# EAGLE design TMC2100_BOB_v0_90 (EAGLE 6.5.0)
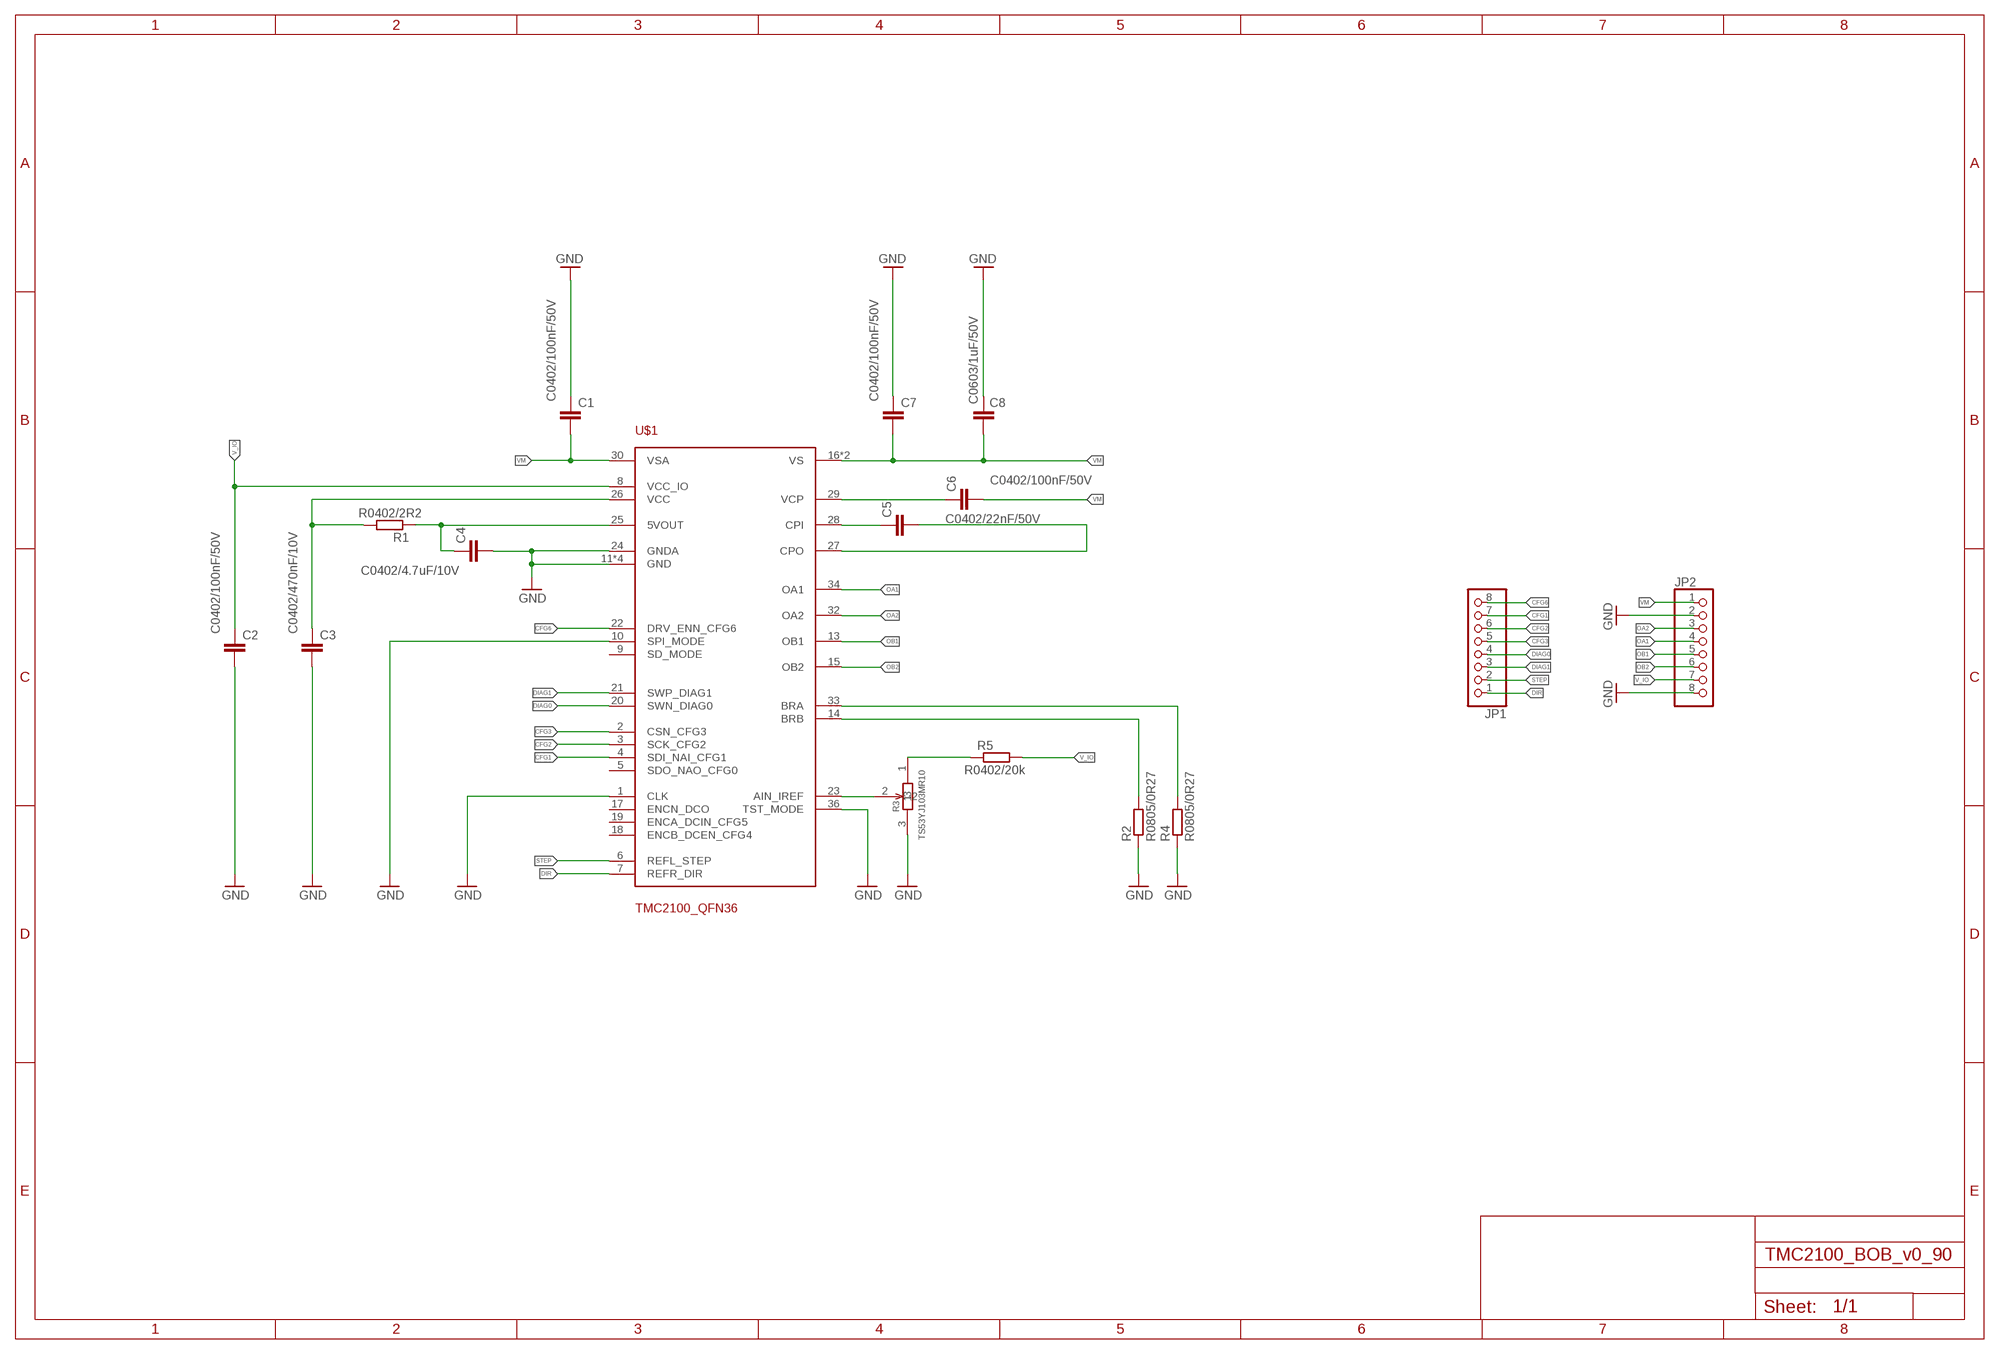
[diagram p0: schematic, sheet 1]

## Parts
C1  C0402/100nF/50V  C-EUC0402  [C0402]
C2  C0402/100nF/50V  C-EUC0402  [C0402]
C3  C0402/470nF/10V  C-EUC0402  [C0402]
C4  C0402/4.7uF/10V  C-EUC0402  [C0402]
C5  C0402/22nF/50V  C-EUC0402  [C0402]
C6  C0402/100nF/50V  C-EUC0402  [C0402]
C7  C0402/100nF/50V  C-EUC0402  [C0402]
C8  C0603/1uF/50V  C-EUC0603  [C0603]
JP1  PINHD-1X08_2.54-S  [1X08-S]
JP2  PINHD-1X08_2.54-S  [1X08-S]
R1  R0402/2R2  R-EU_R0402  [R0402]
R2  R0805/0R27  R-EU_M0805  [M0805]
R3  TS53YJ103MR10  [TS53YJ]
R4  R0805/0R27  R-EU_M0805  [M0805]
R5  R0402/20k  R-EU_R0402  [R0402]
U$1  TMC2100_QFN36  [QFN36]

## Nets
CFG1: JP1.7 U$1.4(SDI_NAI_CFG1)
CFG2: JP1.6 U$1.3(SCK_CFG2)
CFG3: JP1.5 U$1.2(CSN_CFG3)
CFG6: JP1.8 U$1.22(DRV_ENN_CFG6)
DIAG0: JP1.4 U$1.20(SWN_DIAG0)
DIAG1: JP1.3 U$1.21(SWP_DIAG1)
DIR: JP1.1 U$1.7(REFR_DIR)
GND: C1.1 C2.2 C3.2 C4.2 C7.1 C8.2 JP2.2 JP2.8 R2.1 R3.3 R4.1 U$1.1(CLK) U$1.10(SPI_MODE) U$1.11(GND) U$1.12(GND) U$1.24(GNDA) U$1.35(GND) U$1.36(TST_MODE) U$1.GND_PAD(GND)
N$3: C3.1 R1.2 U$1.26(VCC)
N$4: C4.1 R1.1 U$1.25(5VOUT)
N$5: C6.1 U$1.29(VCP)
N$6: C5.1 U$1.28(CPI)
N$7: R4.2 U$1.33(BRA)
N$8: C5.2 U$1.27(CPO)
N$9: R2.2 U$1.14(BRB)
N$10: R3.1 R5.1
N$12: R3.2 U$1.23(AIN_IREF)
OA1: JP2.4 U$1.34(OA1)
OA2: JP2.3 U$1.32(OA2)
OB1: JP2.5 U$1.13(OB1)
OB2: JP2.6 U$1.15(OB2)
STEP: JP1.2 U$1.6(REFL_STEP)
V_IO: C2.1 JP2.7 R5.2 U$1.8(VCC_IO)
VM: C1.2 C6.2 C7.2 C8.1 JP2.1 U$1.16(VS) U$1.30(VSA) U$1.31(VS)
Unconnected: U$1.5(SDO_NAO_CFG0) U$1.9(SD_MODE) U$1.17(ENCN_DCO) U$1.18(ENCB_DCEN_CFG4) U$1.19(ENCA_DCIN_CFG5)

## Library data of the parts
C1-C8 = rcl:C-EU: CAPACITOR, European symbol
JP1 JP2 = pinhead-2:PINHD-1X08: PIN HEADER
R1 R2 R4 R5 = rcl:R-EU_: RESISTOR, European symbol
R3 = TS53YJ103MR10:TS53YJ103MR10
U$1 = TMC2100_QFN:TMC2100_QFN36

## Board
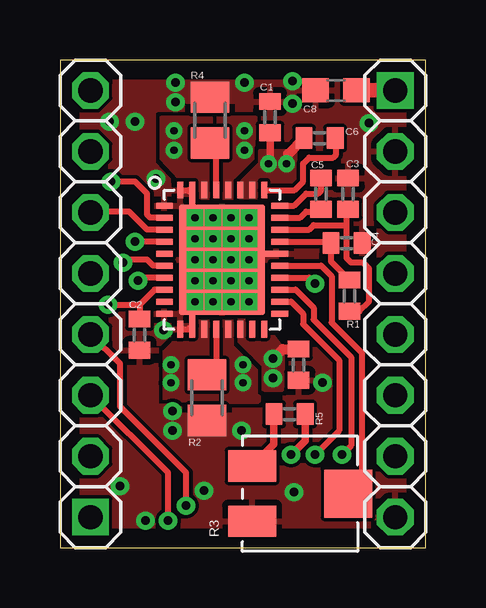
[diagram p1: board, top side]
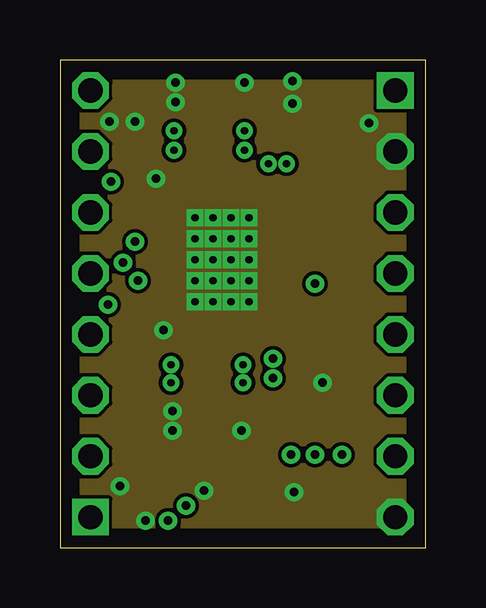
[diagram p2: board, inner layer Ground]
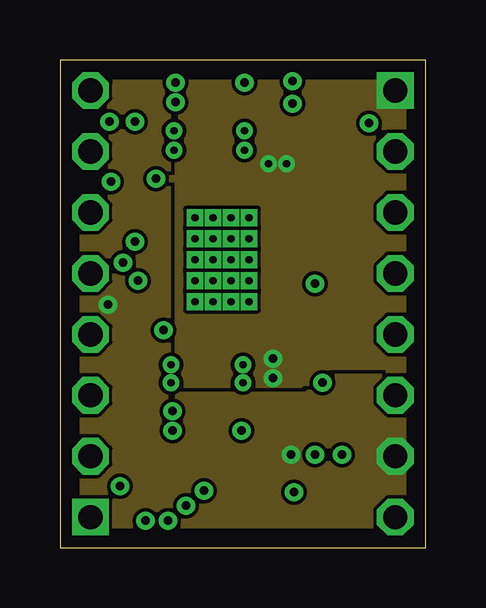
[diagram p3: board, inner layer Supply]
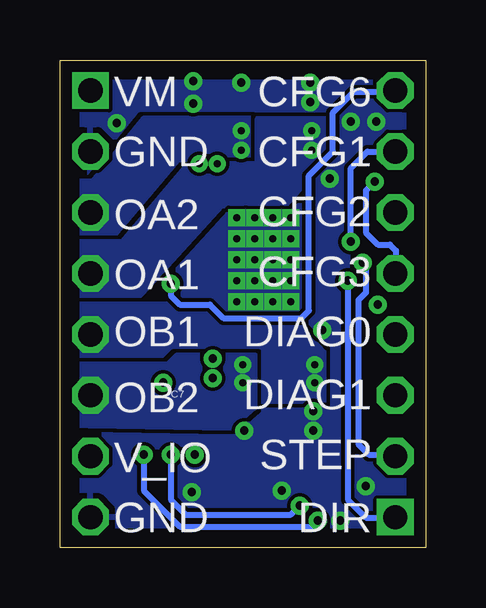
[diagram p4: board, bottom side, seen from below]

Size 15.24 x 20.32 mm. Coordinates in mm from the lower left corner, seen from the top.
Outline: 0,0 15.24,0 15.24,20.32 0,20.32 0,0
Copper layers (1*2*15*16): Top 0.018mm / dielectric 0.36mm / Ground 0.035mm / dielectric 0.71mm / Supply 0.035mm / dielectric 0.2mm / Bottom 0.018mm
Design rules "Default_WE_Euro *": minimum track width 0.15mm, minimum drill 0.25mm, track to track 0.15mm, track to pad 0.15mm, pad to pad 0.1mm, via to via 0.15mm, smd to smd 0mil, copper to edge 0.8mm, drill to drill 8mil, minimum pad ring 10mil, minimum via ring 8mil, stop-mask expansion 4mil, vias tented up to drill 0.4mm, thermal gap 10mil

### Footprints (pad centres in the part's own frame; a part is rotated, then mirrored left to right if it is on the bottom)
C0402 = smd 0.7 x 0.9: 1 -0.65,0; 2 0.65,0
C0603 = smd 1.1 x 1: 1 -0.85,0; 2 0.85,0
1X08-S = drill 1.016 square: 1 -8.89,0 | drill 1.016 octagon: 2 -6.35,0; 3 -3.81,0; 4 -1.27,0; 5 1.27,0; 6 3.81,0; 7 6.35,0; 8 8.89,0
R0402 = smd 0.7 x 0.9: 1 -0.65,0; 2 0.65,0
M0805 = smd 1.3 x 1.6: 1 -0.95,0; 2 0.95,0
TS53YJ = smd 1.3 x 2: 1 -1.15,-2; 3 1.15,-2 | smd 2 x 2: 2 0,2
QFN36 = smd 0.7 x 0.25: 1 -2.4,2.25; 2 -2.4,1.75; 3 -2.4,1.25; 4 -2.4,0.75; 5 -2.4,0.25; 6 -2.4,-0.25; 7 -2.4,-0.75; 8 -2.4,-1.25; 9 -2.4,-1.75; 10 -2.4,-2.25; 19 2.4,-2.25; 20 2.4,-1.75; 21 2.4,-1.25; 22 2.4,-0.75; 23 2.4,-0.25; 25 2.4,0.75; 26 2.4,1.25; 27 2.4,1.75; 28 2.4,2.25 | smd 0.25 x 0.7: 11 -1.75,-2.9; 13 -0.75,-2.9; 14 -0.25,-2.9; 15 0.25,-2.9; 16 0.75,-2.9; 17 1.25,-2.9; 18 1.75,-2.9; 29 1.75,2.9; 30 1.25,2.9; 31 0.75,2.9; 32 0.25,2.9; 33 -0.25,2.9; 34 -0.75,2.9; 36 -1.75,2.9 | smd 0.25 x 1: 12 -1.25,-2.75; 35 -1.25,2.75 | smd 1 x 0.25: 24 2.25,0.25 | smd 3.6 x 4.6: GND_PAD 0,0

### Placement (x,y rotation side)
C1  8.75,17.94 270 top
C2  3.31,8.88 270 top
C3  12,14.75 90 top
C4  11.94,12.69 0 top
C5  10.88,14.75 270 top
C6  10.81,17.06 180 top
C7  9.94,7.62 90 top
C8  11.5,19.06 180 top
JP1  1.27,10.16 90 top
JP2  13.97,10.16 270 top
R1  12.06,10.5 270 top
R2  6.12,6.25 90 top
R3  10,2.25 270 top
R4  6.25,17.81 270 top
R5  9.56,5.56 0 top
U$1  6.75,12 0 top

### Tracks (layer width: path | path; a pad name or v marks a point on that pad's centre or on a via)
CFG1  (via drill 0.35)
  Top 0.254: U$1.4 v3.12,12.75
  Bottom 0.254: v3.12,12.75 3.12,15.81 2.44,16.5 JP1.7
CFG2
  Top 0.254: U$1.3 3.62,13.25 2.88,14 1.3,14 JP1.6
CFG3  (via drill 0.35)
  Top 0.254: U$1.2 3.75,13.75 3.62,13.88 3.62,14.75 3.12,15.25 v2.12,15.25
  Bottom 0.254: v2.12,15.25 2.5,14.88 2.5,13.12 2,12.62 1.5,12.62 1.25,12.38 1.25,11.45 JP1.5
CFG6  (via drill 0.35)
  Top 0.254: U$1.22 10.38,11.25 v10.62,11
  Bottom 0.254: v10.62,11 10.62,10.5 10.25,10.12 9,10.12 8.44,9.56 5.19,9.56 4.88,9.88 4.88,15.5 3.88,16.5 3.88,18.12 3,19 1.32,19 JP1.8
DIAG0  (via drill 0.35)
  Top 0.254: U$1.20 9.62,10.25 10.12,9.75 10.12,9.31 11.62,7.81 11.62,4.88 v10.62,3.88 | v5.25,1.75 5.25,3.12 2.5,5.88 2.5,7.66 JP1.4
  Bottom 0.254: v10.62,3.88 10.62,2 10,1.38 5.62,1.38 v5.25,1.75
DIAG1  (via drill 0.35)
  Top 0.254: v11.75,3.88 12.12,4.25 12.12,7.94 10.56,9.5 10.56,10 9.81,10.75 U$1.21 | v4.5,1.12 4.5,3.12 JP1.3
  Bottom 0.254: v11.75,3.88 11.75,2.38 10.25,0.88 4.75,0.88 v4.5,1.12
DIR  (via drill 0.35)
  Top 0.254: U$1.7 3.38,11.25 v3.25,11.12
  Bottom 0.254: JP1.1 1.29,1.25 2.5,1.25 3.25,2 v3.25,11.12
GND  (via drill 0.3, 0.35)
  Top 0.254: U$1.11 5.35,9.1 U$1.12 | U$1.36 5.35,14.9 U$1.35 | U$1.24 8.12,12.25 v7.88,12
  other vias: 4.81,19.38 4.81,18.56 7.69,19.38 4.69,4.88 4.69,5.69 7.56,4.88 4.31,9.06 5.62,13.75 6.38,13.75 7.12,13.75 7.88,13.75 5.62,12.88 6.38,12.88 7.12,12.88 7.88,12.88 5.62,12 6.38,12 7.12,12 6.38,11.12 5.62,11.12 7.12,11.12 7.88,11.12 5.62,10.25 6.38,10.25 7.12,10.25 7.88,10.25 9.69,19.44 12.88,17.69 10.94,6.88 9.69,18.5 4,15.38 2.06,17.75 3.12,17.75 6,2.38 3.56,1.12 2.5,2.56 9.75,2.31
  pour Top (rank 6): -0.5,20.5 15.5,20.5 15.5,0 -0.5,0
  pour Ground (no thermals): -0.5,20.5 16,20.5 16,0 -0.5,0
  pour Bottom (rank 6): -0.5,20.5 17,20.5 17,0 -0.5,0
  pour Top (no thermals): 5.25,18.62 7.75,18.62 7.75,20.12 5.25,20.12
  pour Top (no thermals): 5,4.25 7.25,4.25 7.25,5.5 5,5.5
N$3
  Top 0.254: R1.2 12.47,9.85 12.88,10.25 12.88,11.62 12.62,11.88 12.12,11.88 11.94,12.06 11.94,13.44 | U$1.26 10.38,13.25 10.56,13.44 11.94,13.44 | 11.88,13.97 C3.1 11.94,14.04 11.94,13.44
N$4
  Top 0.254: R1.1 11.29,11.93 C4.1 11.22,12.75 U$1.25
N$5
  Top 0.254: U$1.29 9.78,14.9 10.12,15.25 10.12,16 10.38,16.25 11.38,16.25 11.5,16.38 11.5,17.02 C6.1
N$6
  Top 0.254: U$1.28 9.75,14.25 10.25,14.75 10.75,14.75 10.88,14.88 C5.1
N$7
  Top 0.254: U$1.33 6.5,16.61 R4.2
N$8
  Top 0.254: U$1.27 10,13.75 10.25,14 10.78,14 C5.2
N$9
  Top 0.254: U$1.14 6.5,7.58 R2.2
N$10
  Top 0.305: R5.1 8.91,4.31 R3.1
N$12
  Top 0.254: U$1.23 10.88,11.75 11.31,11.31 11.31,9.38 12.56,8.12 12.56,2.81 R3.2
OA1  (via drill 0.3)
  other vias: 4.75,17.38 4.75,16.56
  pour Top (rank 2, no thermals): 6.25,14.62 6.25,17.88 4.25,17.88 4.25,16.25 5,15.44 5.88,15.38 5.88,14.62
  pour Bottom (rank 3, no thermals): 13,10.12 15.25,10.12 15.25,12.75 12.62,12.75 9.88,16 7,16 7,17.88 4.25,17.88 4.25,16.12 5.88,14.25 8.5,14.25 12.25,10.12
OA2  (via drill 0.3)
  other vias: 7.69,17.38 7.69,16.56
  pour Top (rank 3, no thermals): 8.12,14.62 8.12,17.88 6.38,17.88 6.38,14.62
  pour Bottom (rank 4, no thermals): 15.25,13 12.62,13 9.88,16.12 7.12,16.12 7.12,17.88 11.75,17.88 13.88,15.25 15.25,15.25
OB1  (via drill 0.3)
  other vias: 4.62,6.88 4.62,7.62
  pour Top (rank 2, no thermals): 6.5,6.12 6.5,9.38 5.75,9.38 5.75,8.5 4.75,8.5 4.38,8.12 4.38,6.12
  pour Bottom (rank 2, no thermals): 15.25,9.88 15.25,7.75 10.75,7.75 10.38,8.12 7,8.12 7,6.12 4.25,6.12 4.25,8.12 5.75,9.75 8.62,9.75 9,10.12 15.25,10.12 15.25,10
OB2  (via drill 0.3)
  other vias: 7.62,7.62 7.62,6.88
  pour Top (rank 3, no thermals): 8.25,6.12 8.25,9.38 6.5,9.38 6.5,6.12
  pour Bottom (no thermals): 15.25,7.62 15.25,5.12 8.12,5 7.12,5.88 7.12,8 10.38,8 10.75,7.62
STEP  (via drill 0.35)
  Top 0.254: U$1.6 3.88,11.75 3.62,12 2.75,12 v2.62,11.88
  Bottom 0.254: JP1.2 1.33,3.88 2.38,3.88 2.81,4.31 2.81,10.31 2.5,10.62 2.5,11.75 v2.62,11.88
V_IO  (via drill 0.35)
  Top 0.254: 3.31,10.12 C2.1 | v2,10.12 3.31,10.12 | U$1.8 3.94,10.75 3.31,10.12
  Top 0.305: R5.2 10.21,4.46 v9.62,3.88
  pour Supply (no thermals): 15.25,0 15.25,7.12 11,7.12 10.25,6.38 5.12,6.38 4.5,7 4.5,20.25 0,20.25 0,0
VM  (via drill 0.3, 0.35)
  Top 0.305: C1.2 8.75,16.06 v8.69,16 | v9.44,16 9.44,16.31 9.5,16.38
  Top 0.406: 9.5,16.4 C6.2 | v8.88,7.88 9.28,8.28 C7.2
  Top 0.61: JP2.1 12.36,19.05 C8.1
  other vias: 8.88,7.06
  pour Supply (rank 2, no thermals): -0.5,20.5 16.5,20.5 16.5,0 -0.5,0
  pour Top (no thermals): 7.5,14.62 7.5,15.12 8.38,16 8.38,16.5 9.75,16.5 9.75,15 9.38,14.62
  pour Top (no thermals): 7.5,9.5 7.5,8.62 8.5,7.62 8.5,6.62 9.25,6.62 9.25,8.25 8.88,8.75 8.12,8.75 7.88,8.88 7.88,9.5

### Text on the board
bNames: CFG6 | VM | CFG1 | GND | CFG2 | OA2 | CFG3 | OA1 | DIAG0 | OB1 | DIAG1 | OB2 | STEP | V_IO | DIR | GND